# Altium schematic sheet Sch_SHT40-BMP280.SchDoc
size A; SheetNumber: 1; SheetTotal: 1
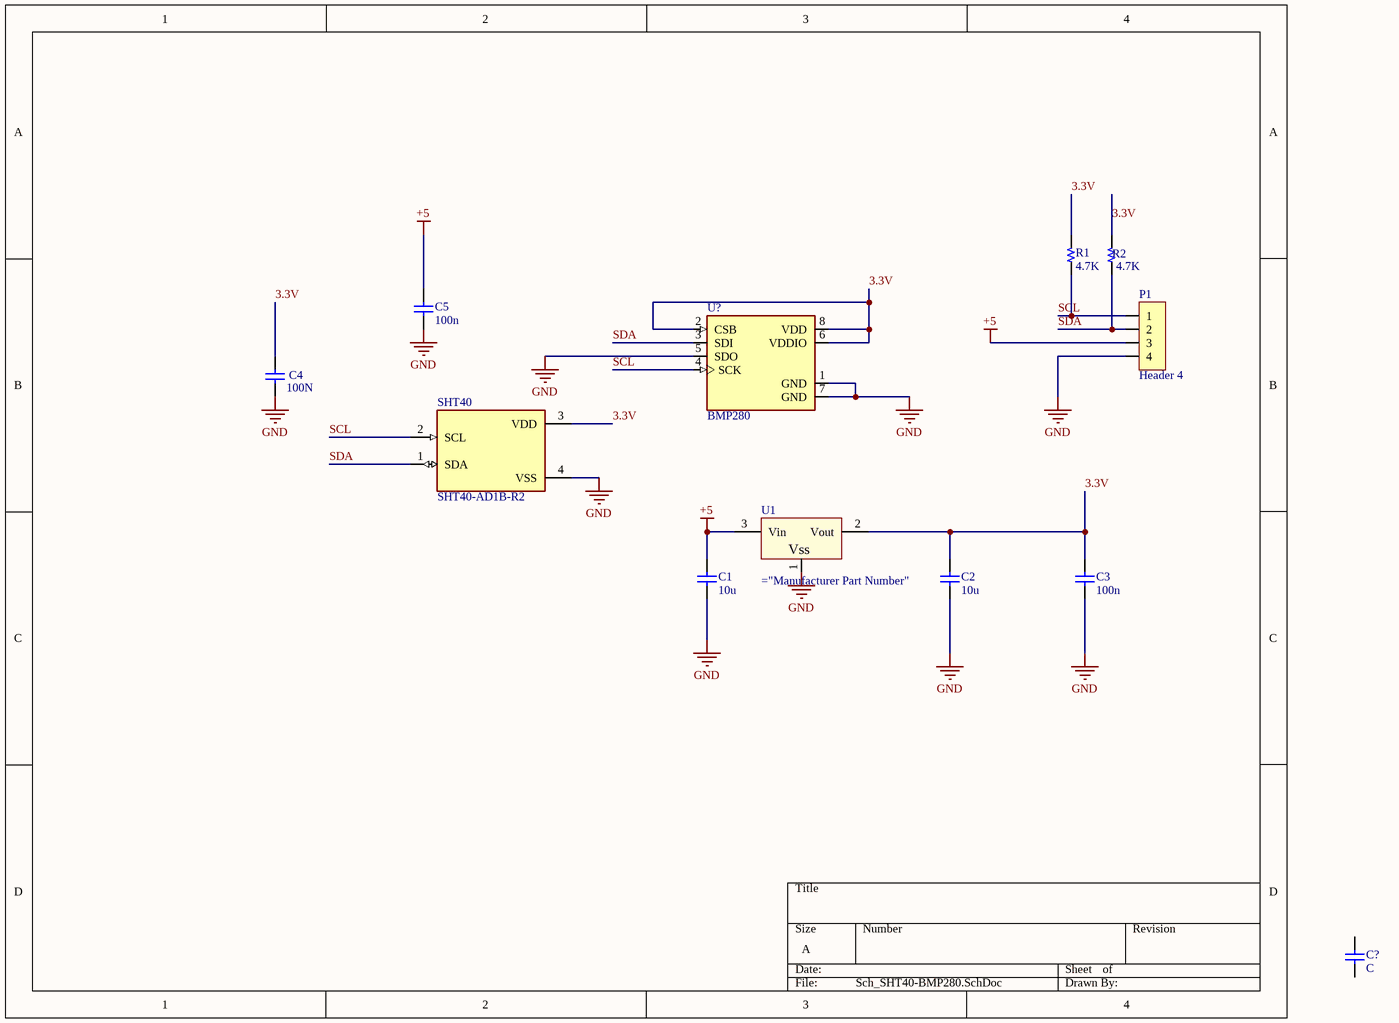
[diagram p0: Sch_SHT40-BMP280.SchDoc]

## Parts
C1  10u  [C 0805]
C2  10u  [C 0805]
C3  100n  [C 0805]
C4  100N  [C 0805]
C5  100n  [C 0805]
C?  C  [C 1206]
P1  Header 4  [HDR/Header/4/2mm/BOX/RA]
R1  4.7K  [R 0805]
R2  4.7K  [R 0805]
SHT40  SHT40-AD1B-R2  [SHT4X]
U1  (no value)  [SOT-23]
U?  BMP280  [XDCR_BMP280]

## Nets
+5: C1.1 C5.1 P1.3 U1.3(Vin)
GND: C1.2 C2.2 C3.2 C4.2 C5.2 P1.4 SHT40.4(VSS) U1.1(VSS) U?.1(GND) U?.5(SDO) U?.7(GND)
3.3V: C2.1 C3.1 C4.1 R1.2 R2.2 SHT40.3(VDD) U1.2(Vout) U?.2(CSB) U?.6(VDDIO) U?.8(VDD)
SCL: P1.1 R1.1 SHT40.2(SCL) U?.4(SCK)
SDA: P1.2 R2.1 SHT40.1(SDA) U?.3(SDI)

Not connected (* = marked no-connect by the designer): C? 1 2

## Notes on the sheet
- (in symbol XC6206P302MR-G) Vss

## Library data of the parts
C1-C5 C? = Capacitor NP: Capacitor non-pol
P1 = Header 4: Header, 4-Pin
R1 R2 = Resistor
SHT40 = SHT40-AD1B-R2: Humidity/Temperature Sensor Digital Serial (I2C) 4-Pin DFN EP T/R; MF: Sensirion AG; Package: None; Value: *; Purchase-URL: https://pricing.snapeda.com/search/part/SHT40-AD1B-R2/?ref=eda; Availability: In Stock; MP: SHT40-AD1B-R2; Check_prices: https://www.snapeda.com/parts/SHT40-AD1B-R2/NSI/view-part/?ref=eda; SnapEDA_Link: https://www.snapeda.com/parts/SHT40-AD1B-R2/NSI/view-part/?ref=snap; Price: None
U1 = XC6206P302MR-G: LDO Voltage Regulators 1uA Low Quiescent 3 Terminal, Low ESR Cap. Compatible, Voltage Regulator; Brand: Torex Semiconductor; Package: SOT-23-3; Type: SMD
U? = BMP280: BMP280 Absolute Barometric Pressure Sensor for Battery Powered Devices 2 x 2.5mm; Package: None; Availability: Unavailable; MP: BMP280; Value: *; Price: None